# Altium schematic sheet Solar_supply.SchDoc: =ProjectName
size A4; CheckedBy: DatNB; Author: Ven; CompanyName: Nacentech; Organization: IMET
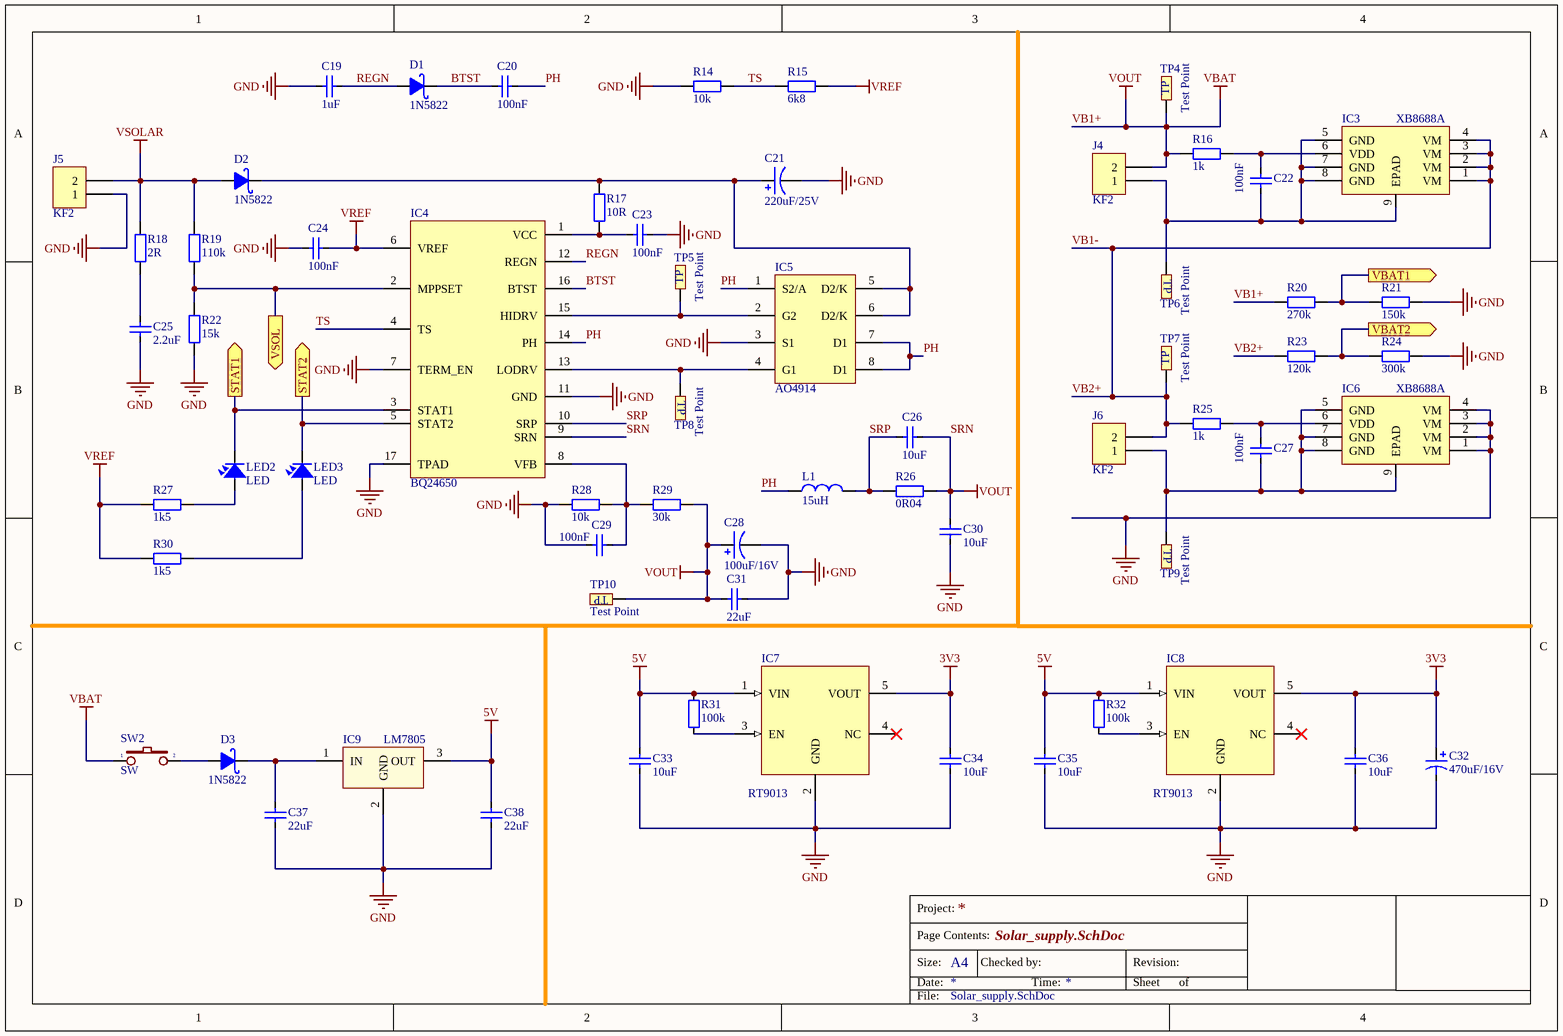
[diagram p0: Solar_supply.SchDoc]

## Parts
C19  1uF  [CAP_0805]
C20  100nF  [CAP_0805]
C21  220uF/25V  [C5mm]
C22  100nF  [CAP_0805]
C23  100nF  [CAP_0805]
C24  100nF  [CAP_0805]
C25  2.2uF  [CAP_0805]
C26  10uF  [CAP_0805]
C27  100nF  [CAP_0805]
C28  100uF/16V  [C5mm]
C29  100nF  [CAP_0805]
C30  10uF  [CAP_0805]
C31  22uF  [CAP_0805]
C32  470uF/16V  [C8mm]
C33  10uF  [CAP_0805]
C34  10uF  [CAP_0805]
C35  10uF  [CAP_0805]
C36  10uF  [CAP_0805]
C37  22uF  [CAP_0805]
C38  22uF  [CAP_0805]
D1  1N5822  [DIO-214AC(SMA)]
D2  1N5822  [DIO-214AC(SMA)]
D3  1N5822  [DIO-214AC(SMA)]
IC3  XB8688A  [SOP8-PP]
IC4  BQ24650  [VQFN-16]
IC5  AO4914  [SOIC-8]
IC6  XB8688A  [SOP8-PP]
IC7  RT9013  [SOT23-5]
IC8  RT9013  [SOT23-5]
IC9  LM7805  [TO-252]
J4  KF2  [KF2-5.08]
J5  KF2  [KF2-5.08]
J6  KF2  [KF2-5.08]
L1  15uH  [L-SMD-M-7.3x4.5]
LED2  LED  [LED-0805-Red]
LED3  LED  [LED-0805-Orange]
R14  10k  [RES-SMD-0805]
R15  6k8  [RES-SMD-0805]
R16  1k  [RES-SMD-0805]
R17  10R  [RES-SMD-0805]
R18  2R  [RES-SMD-0805]
R19  110k  [RES-SMD-0805]
R20  270k  [RES-SMD-0805]
R21  150k  [RES-SMD-0805]
R22  15k  [RES-SMD-0805]
R23  120k  [RES-SMD-0805]
R24  300k  [RES-SMD-0805]
R25  1k  [RES-SMD-0805]
R26  0R04  [RES-SMD-2512]
R27  1k5  [RES-SMD-0805]
R28  10k  [RES-SMD-0805]
R29  30k  [RES-SMD-0805]
R30  1k5  [RES-SMD-0805]
R31  100k  [RES-SMD-0805]
R32  100k  [RES-SMD-0805]
SW2  SW  [SW2]
TP4  Test Point  [TP_SMD]
TP5  Test Point  [TP_SMD]
TP6  Test Point  [TP_SMD]
TP7  Test Point  [TP_SMD]
TP8  Test Point  [TP_SMD]
TP9  Test Point  [TP_SMD]
TP10  Test Point  [TP_SMD]

## Ports
STAT1 (out), STAT2 (out), VBAT1 (out), VBAT2 (out), VSOL (out)

## Nets
3V3: C32.1 C34.2 C36.2 IC7.5(VOUT) IC8.5(VOUT)
5V: C33.2 C35.2 C38.2 IC7.1(VIN) IC8.1(VIN) IC9.3(OUT) R31.1 R32.1
GND: C19.2 C21.2 C23.2 C24.2 C25.1 C28.2 C29.1 C30.1 C31.1 C32.2 C33.1 C34.1 C35.1 C36.1 C37.1 C38.1 IC4.7(TERM_EN) IC4.11(GND) IC4.17(TPAD) IC5.3(S1) IC6.1(VM) IC6.2(VM) IC6.3(VM) IC6.4(VM) IC7.2(GND) IC8.2(GND) IC9.2(GND) J5.1 R14.1 R21.1 R22.2 R24.1 R28.1
SRN: C26.1 C28.1 C30.2 C31.2 IC4.9(SRN) J4.2 R16.2 R20.2 R26.2 R29.1 SW2.1 TP4.1 TP10.1  [also labelled VB1+, VBAT, VOUT]
VREF: C24.1 IC4.6(VREF) R15.2 R27.1 R30.1
VSOLAR: D2.1(A) J5.2 R18.1 R19.2
BTST: C20.1 D1.2(K) IC4.16(BTST)
PH: C20.2 IC4.14(PH) IC5.1(S2/A) IC5.7(D1) IC5.8(D1) L1.1
REGN: C19.1 D1.1(A) IC4.12(REGN)
SRP: C26.2 IC4.10(SRP) L1.2 R26.1
STAT1: IC4.3(STAT1) LED2.2 ; port STAT1
STAT2: IC4.5(STAT2) LED3.2 ; port STAT2
TS: IC4.4(TS) R14.2 R15.1
VB1-: IC3.1(VM) IC3.2(VM) IC3.3(VM) IC3.4(VM) J6.2 R23.2 R25.2 TP7.1  [also labelled VB2+]
VBAT1: R20.1 R21.2 ; port VBAT1
VBAT2: R23.1 R24.2 ; port VBAT2
VSOL: IC4.2(MPPSET) R19.1 R22.1 ; port VSOL
NetC21_1: C21.1 D2.2(K) IC5.5(D2/K) IC5.6(D2/K) R17.1
NetC22_1: C22.1 IC3.5(GND) IC3.7(GND) IC3.8(GND) IC3.9(EPAD) J4.1 TP6.1
NetC22_2: C22.2 IC3.6(VDD) R16.1
NetC23_1: C23.1 IC4.1(VCC) R17.2
NetC25_2: C25.2 R18.2
NetC27_1: C27.1 IC6.5(GND) IC6.7(GND) IC6.8(GND) IC6.9(EPAD) J6.1 TP9.1
NetC27_2: C27.2 IC6.6(VDD) R25.1
NetC29_2: C29.2 IC4.8(VFB) R28.2 R29.2
NetC37_2: C37.2 D3.2(K) IC9.1(IN)
NetD3_1: D3.1(A) SW2.2
NetIC4_13: IC4.13(LODRV) IC5.4(G1) TP8.1
NetIC4_15: IC4.15(HIDRV) IC5.2(G2) TP5.1
NetIC7_3: IC7.3(EN) R31.2
NetIC8_3: IC8.3(EN) R32.2
NetLED2_1: LED2.1 R27.2
NetLED3_1: LED3.1 R30.2

Not connected (* = marked no-connect by the designer): IC7 4(NC)*; IC8 4(NC)*

## Notes on the sheet
- Project:
- Page Contents:
- Size:
- Date:
- A4
- Checked by:
- Time:
- Revision:
- Sheet
- of
- File:

## Library data of the parts
C19 C20 C22-C27 C29-C31 C33-C38 = CapSMD: Capacitor; Value: 33p; Published: 8-Jun-2000; LatestRevisionDate: 17-Jul-2002; LatestRevisionNote: Re-released for DXP Platform.; PackageReference: RAD-0.3; Publisher: Altium Limited
C21 C28 C32 = Cap Pol: Polarized Capacitor (Axial); Published: 8-Jun-2000; LatestRevisionDate: 17-Jul-2002; LatestRevisionNote: Re-released for DXP Platform.; PackageReference: POLAR0.8; Publisher: Altium Limited
D1-D3 = 1N5822: Schottky Rectifiers; Value: Diode c?m 1N5408
IC3 IC6 = XB8688: One Cell Lithium-ion/Polymer Battery Protection IC
IC4 = BQ24650: BQ24650 Stand-Alone Synchronous Buck Battery Charge Controller for Solar Power / With Maximum Power Point Tracking
IC5 = AO4914: Dual N-Channel Enhancement Mode Field Effect Transistor with Schottky Diode
IC7 IC8 = RT9013: RT9013-33GB IC REG LINEAR 3.3V 500mA SOT23-5
IC9 = LM78xx: LDO to 5V; Value: LM7805
J4-J6 = KF2: Manufacturer: Würth Elektronik eiSos GmbH; partNo: 691103110002; ComponentLink1 Description: Manufacturer; ComponentLink2 Description: Datasheet; NoPins: 2; Created Date: 29 October 2013; ComponentLink1URL: http://www.we-online.com; ComponentLink2URL: http://katalog.we-online.de/em/datasheet/6911031100xx.pdf; Created by: Karrer Zheng
L1 = Inductor: Value: 150 mH
LED2 LED3 = LED: LED Single colour Green and Red; Value: LED 3 ly Single Colour
R14-R30 = Resistor - SMD: Resistor SMD; Manufacturer: Generic Components; Class: Passive; Published: 08/06/2000; Publisher: Altium Hobart Technology Centre
R31 R32 = Resistor - SMD: Resistor; Manufacturer: Generic Components; Class: Passive; Published: 08/06/2000; Publisher: Altium Hobart Technology Centre
SW2 = SW2: Switch button 2 pin; Value: SW chip 2 pin
TP4-TP10 = TP: CONNECT 1